# Altium project auto_threader.PrjPcb (part 3 of 3)
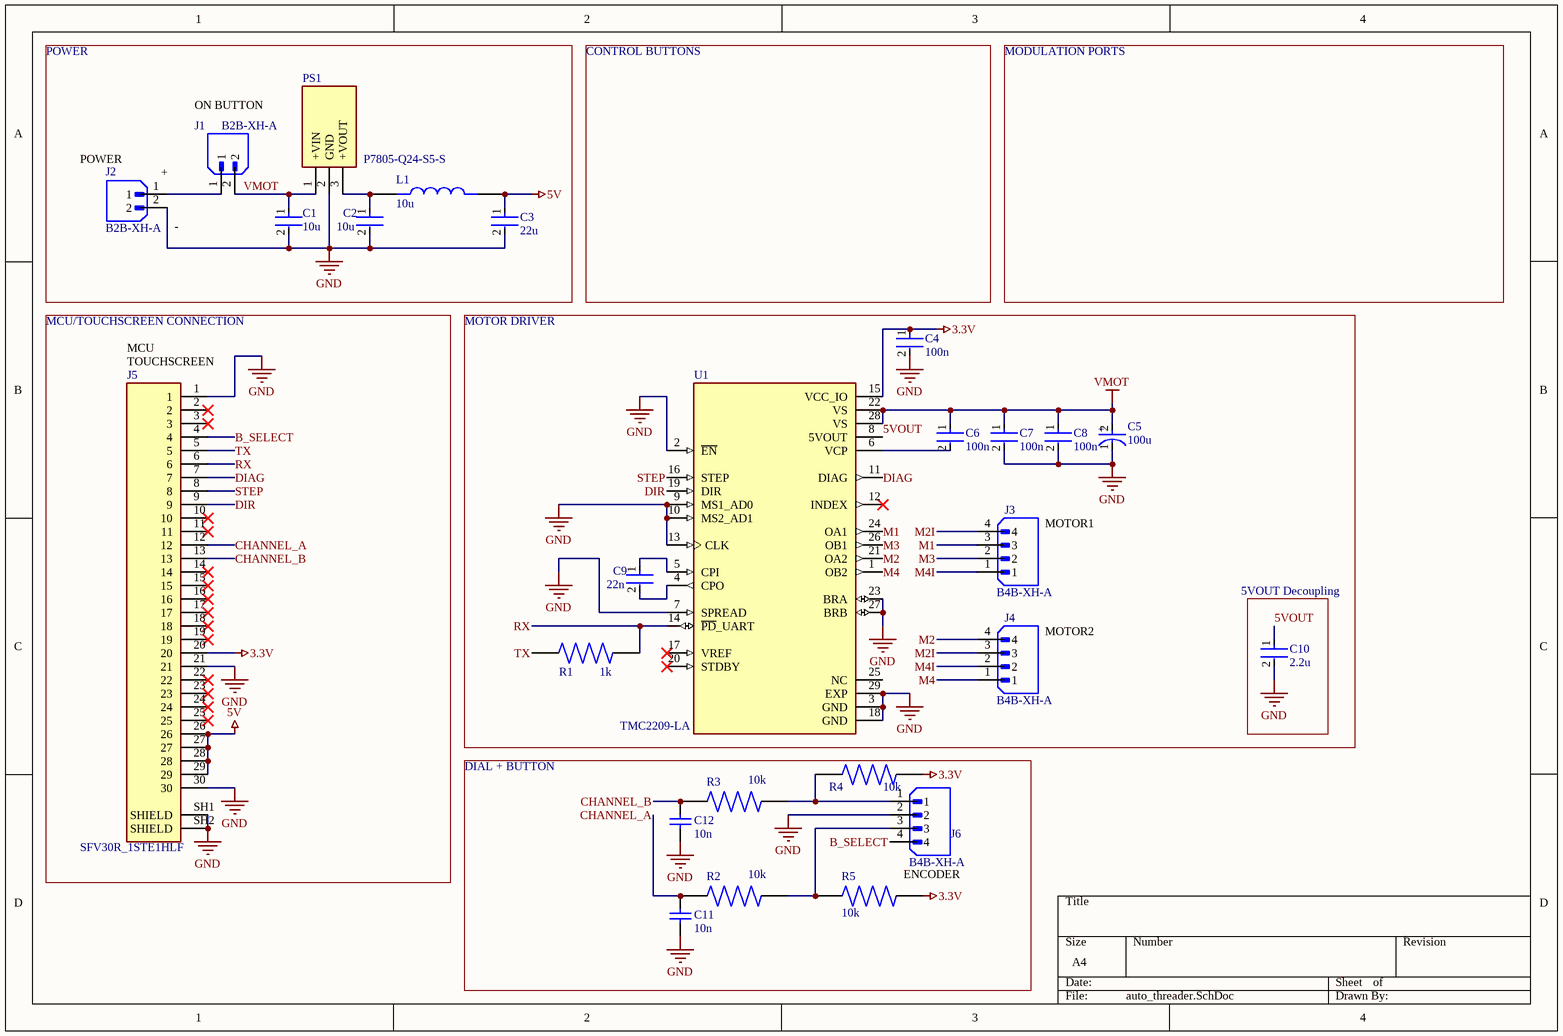
[diagram p2: auto_threader.SchDoc]

## Sheet auto_threader.SchDoc (continued)

### Library data of the parts (continued)
R2-R5 = RC0805FR-0710KL: Res General Purpose Thick Film 0805 10k Ohm 1% 1/8W ±100ppm/°C Ceramic Paper T/R; Manufacturer: Yageo Group; Max Power Dissipation: 125mW; Value: 10kΩ; Voltage Rating: 150V; Supplier: DigiKey; Supplier Part Number: 311-10.0KCRDKR-ND; Manufacturer Part Number: RC0805FR-0710KL; RoHS: Compliant; Category: Chip SMD Resistors; Stock: 2901046; Pricing: 1=0.1, 10=0.034, 25=0.0256, 50=0.0208, 100=0.0171, 250=0.01344, 500=0.01136, 1000=0.00973 (USD); Case/Package: 0805; Case Code (Imperial): 0805; China RoHS: Non-Compliant; Composition: Thick Film; Contact Plating: Tin; Country of Origin: Mainland China, Taiwan; Depth: 1.25mm; Export Control Classification Number (ECCN) Code: EAR99; Features: Moisture Resistant; Height: 500µm; Harmonized Tariff Schedule (HTS) Code: 8533.21.00.30; Introduction Date: 2004-09-22; Lead Free: Lead Free; Length: 2mm; Lifecycle Status: Production; Max Operating Temperature: 155°C; Military Standard: Not; Min Operating Temperature: -55°C; Mounting Technology: Surface Mount; Pins: 2; Number of Terminals: 2; Number of Terminations: 2; Packaging: Tape and Reel; Power Rating: 125mW; Radiation Hardening: No; REACH SVHC: Yes; Schedule B: 8533210045, 8533210045|8533210045|8533210045|8533210045|8533210045|8533210045|8533210045|8533210045|8533210045|8533210045|8533210045|8533210045|8533210045|8533210045|8533210045|8533210045|8533210045|8533210045|8533210045|8533210045|8533210045|8533210045|8533210045|85; Temperature Coefficient: 100ppm/°C; Termination: SMD/SMT; Tolerance: 1%; Voltage Rating (AC): 150V; Voltage Rating (DC): 150V; Width: 1.25mm; Working Voltage: 150V; ComponentLink1URL: https://datasheet.octopart.com:443/RC0805FR-0710KL-Yageo-datasheet-175887523.pdf?src-supplier=Newark; ComponentLink1Description: https://datasheet.octopart.com:443/RC0805FR-0710KL-Yageo-datasheet-175887523.pdf?src-supplier=Newark; ComponentLink2URL: https://datasheet.octopart.com:443/RC0805FR-0710KL-Yageo-datasheet-62067350.pdf?src-supplier=Farnell; ComponentLink2Description: https://datasheet.octopart.com:443/RC0805FR-0710KL-Yageo-datasheet-62067350.pdf?src-supplier=Farnell; ComponentLink3URL: https://datasheet.octopart.com:443/RC0805FR-0710KL-Yageo-datasheet-13691069.pdf?src-supplier=Farnell; ComponentLink3Description: https://datasheet.octopart.com:443/RC0805FR-0710KL-Yageo-datasheet-13691069.pdf?src-supplier=Farnell; ComponentLink4URL: https://datasheet.octopart.com:443/RC0805FR-0710KL-Yageo-datasheet-103092701.pdf?src-supplier=Upverter; ComponentLink4Description: https://datasheet.octopart.com:443/RC0805FR-0710KL-Yageo-datasheet-103092701.pdf?src-supplier=Upverter; ComponentLink5URL: https://datasheet.octopart.com:443/RC0805FR-0710KL-Yageo-datasheet-98239111.pdf?src-supplier=Upverter; ComponentLink5Description: https://datasheet.octopart.com:443/RC0805FR-0710KL-Yageo-datasheet-98239111.pdf?src-supplier=Upverter; ComponentLink6URL: https://datasheet.octopart.com:443/RC0805FR-0710KL-Yageo---Phycomp-datasheet-67302840.pdf?src-supplier=Upverter; ComponentLink6Description: https://datasheet.octopart.com:443/RC0805FR-0710KL-Yageo---Phycomp-datasheet-67302840.pdf?src-supplier=Upverter; ComponentLink7URL: https://datasheet.octopart.com:443/RC0805FR-0710KL-Yageo-datasheet-8330313.pdf?src-supplier=element14+APAC; ComponentLink7Description: https://datasheet.octopart.com:443/RC0805FR-0710KL-Yageo-datasheet-8330313.pdf?src-supplier=element14+APAC; ComponentLink8URL: https://datasheet.octopart.com:443/RC0805FR-0710KL-Yageo-datasheet-12592811.pdf?src-supplier=element14+APAC; ComponentLink8Description: https://datasheet.octopart.com:443/RC0805FR-0710KL-Yageo-datasheet-12592811.pdf?src-supplier=element14+APAC; ComponentLink9URL: https://datasheet.octopart.com:443/RC0805FR-0710KL-Yageo-Group-datasheet-190305687.pdf?src-supplier=Future+Electronics; ComponentLink9Description: https://datasheet.octopart.com:443/RC0805FR-0710KL-Yageo-Group-datasheet-190305687.pdf?src-supplier=Future+Electronics; ComponentLink10URL: https://datasheet.octopart.com:443/RC0805FR-0710KL-Yageo-datasheet-164759695.pdf?src-supplier=Future+Electronics; ComponentLink10Description: https://datasheet.octopart.com:443/RC0805FR-0710KL-Yageo-datasheet-164759695.pdf?src-supplier=Future+Electronics; ComponentLink11URL: https://datasheet.octopart.com:443/RC0805FR-0710KL-Yageo-datasheet-15800360.pdf?src-supplier=Future+Electronics; ComponentLink11Description: https://datasheet.octopart.com:443/RC0805FR-0710KL-Yageo-datasheet-15800360.pdf?src-supplier=Future+Electronics; ComponentLink12URL: https://datasheet.octopart.com:443/RC0805FR-0710KL-Yageo-datasheet-8324252.pdf?src-supplier=Future+Electronics; ComponentLink12Description: https://datasheet.octopart.com:443/RC0805FR-0710KL-Yageo-datasheet-8324252.pdf?src-supplier=Future+Electronics; ComponentLink13URL: https://datasheet.octopart.com:443/RC0805FR-0710KL-Yageo-datasheet-79472498.pdf?src-supplier=Megastar; ComponentLink13Description: https://datasheet.octopart.com:443/RC0805FR-0710KL-Yageo-datasheet-79472498.pdf?src-supplier=Megastar; ComponentLink14URL: https://datasheet.octopart.com:443/RC0805FR-0710KL-Yageo-datasheet-27714392.pdf?src-supplier=Seeed+Studio; ComponentLink14Description: https://datasheet.octopart.com:443/RC0805FR-0710KL-Yageo-datasheet-27714392.pdf?src-supplier=Seeed+Studio; ComponentLink15URL: https://datasheet.octopart.com/RC0805FR-0710KL-Yageo-datasheet-73766026.pdf; ComponentLink15Description: https://datasheet.octopart.com/RC0805FR-0710KL-Yageo-datasheet-73766026.pdf; ComponentLink16URL: https://datasheet.octopart.com:443/RC0805FR-0710KL-Yageo-datasheet-118657.pdf?src-supplier=DigiKey; ComponentLink16Description: https://datasheet.octopart.com:443/RC0805FR-0710KL-Yageo-datasheet-118657.pdf?src-supplier=DigiKey; ComponentLink17URL: https://datasheet.octopart.com:443/RC0805FR-0710KL-Yageo-datasheet-502840.pdf?src-supplier=element14; ComponentLink17Description: https://datasheet.octopart.com:443/RC0805FR-0710KL-Yageo-datasheet-502840.pdf?src-supplier=element14; ComponentLink18URL: http://sigma.octopart.com:80/conflict_mineral_statement/Yageo-company-3.pdf?src-supplier=Compliance+Statements; ComponentLink18Description: http://sigma.octopart.com:80/conflict_mineral_statement/Yageo-company-3.pdf?src-supplier=Compliance+Statements; ComponentLink19URL: http://sigma.octopart.com:80/rohs_statement/Yageo-company-2.pdf?src-supplier=Compliance+Statements; ComponentLink19Description: http://sigma.octopart.com:80/rohs_statement/Yageo-company-2.pdf?src-supplier=Compliance+Statements; Supplier 1: DigiKey; Supplier Part Number 1: 311-10.0KCRDKR-ND
J5 = SFV30R_1STE1HLF: Supplier 1: DigiKey; Supplier Part Number 1: 609-4326-1-ND
U1 = TMC2209-LA: Supplier 1: DigiKey; Supplier Part Number 1: 505-TMC2209-LA-ND